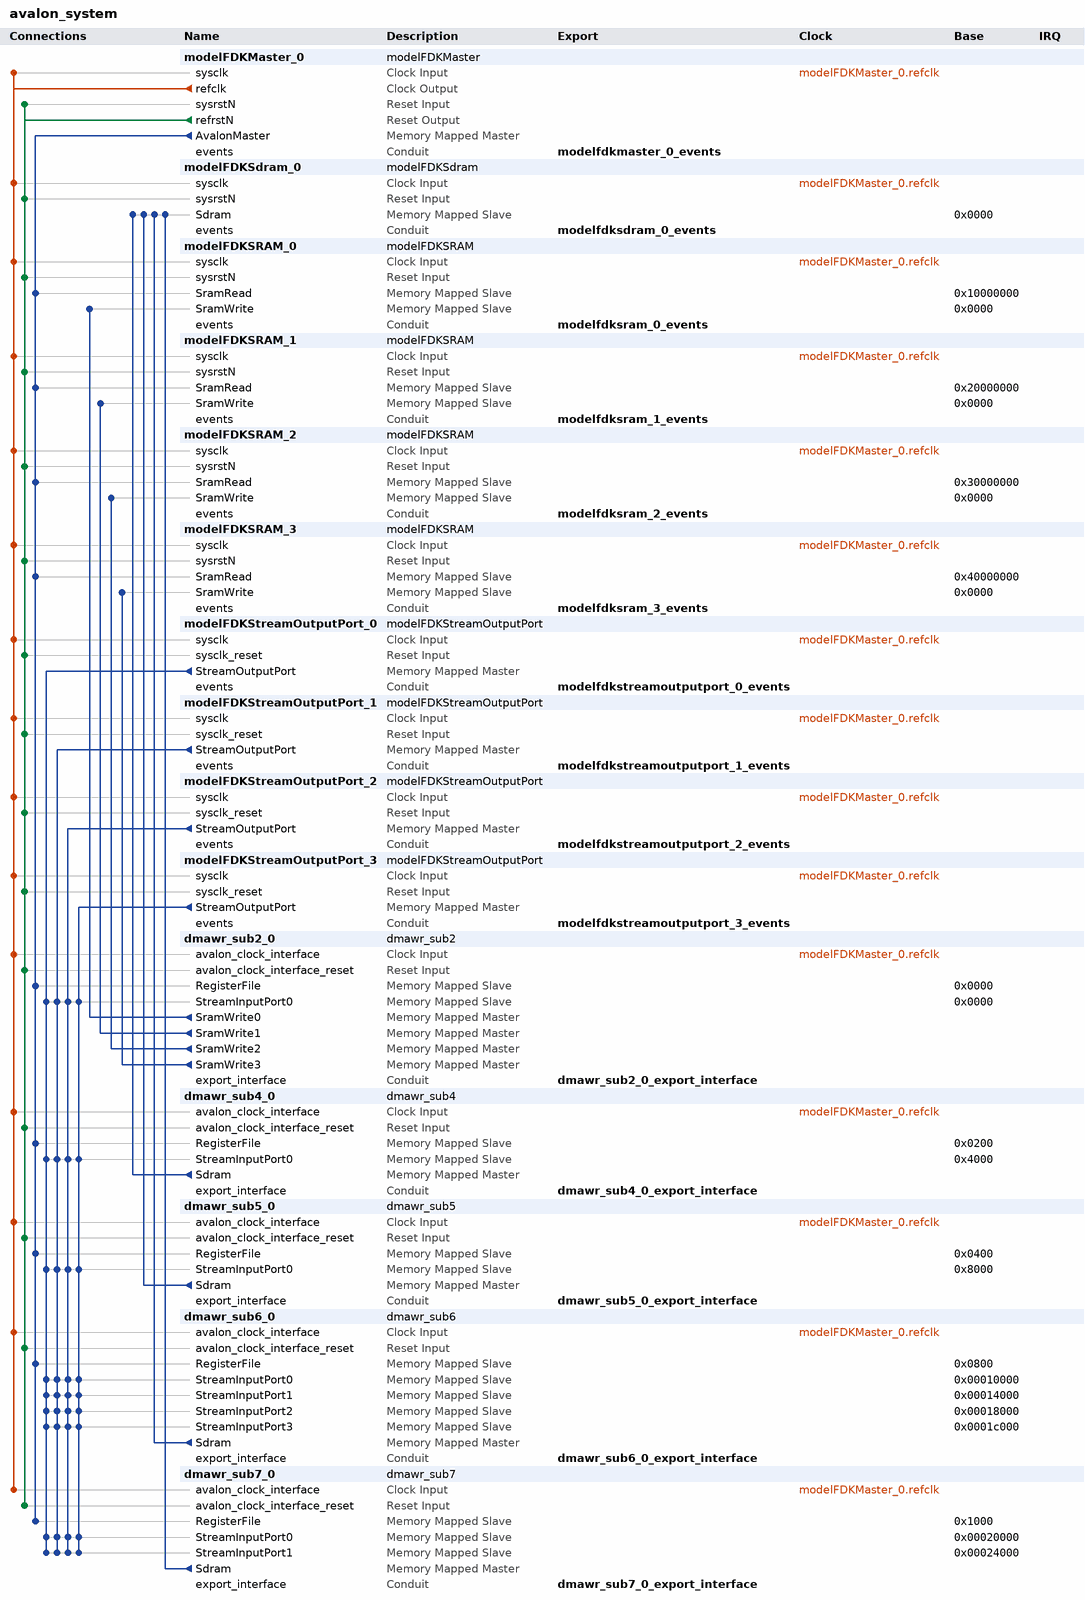
[diagram p0: system contents]
# Platform Designer (Qsys) system avalon_system, Stratix V 5SGSMD5K3F40C4
# Parameters at their usual value, and those the tool derives, are not listed.
package require qsys
create_system avalon_system
set_project_property DEVICE_FAMILY {Stratix V}
set_project_property DEVICE 5SGSMD5K3F40C4

add_instance modelFDKMaster_0 modelFDKMaster 1.0
set_instance_parameter_value modelFDKMaster_0 CMDFILENAME modelmaster0.in
set_instance_parameter_value modelFDKMaster_0 CLKPERIOD 13
set_instance_parameter_value modelFDKMaster_0 ADDREFCLOCK2X false
set_instance_parameter_value modelFDKMaster_0 ADDRBUSWIDTH 32
set_instance_parameter_value modelFDKMaster_0 DATABUSWIDTH 64

add_instance modelFDKSdram_0 modelFDKSdram 1.0
set_instance_parameter_value modelFDKSdram_0 DMPFILENAME ../results/sdramModel.dmp
set_instance_parameter_value modelFDKSdram_0 INITFILENAME sdramModel.init
set_instance_parameter_value modelFDKSdram_0 ADDRBUSWIDTH 24
set_instance_parameter_value modelFDKSdram_0 DATABUSWIDTH 512
set_instance_parameter_value modelFDKSdram_0 WAITCNTRMAX 10
set_instance_parameter_value modelFDKSdram_0 WAITSTART 5
set_instance_parameter_value modelFDKSdram_0 WAITSTOP 2

add_instance modelFDKSRAM_0 modelFDKSRAM 1.0
set_instance_parameter_value modelFDKSRAM_0 DMPFILENAME ../results/sramModel0.dmp
set_instance_parameter_value modelFDKSRAM_0 INITFILENAME sramModel0.init
set_instance_parameter_value modelFDKSRAM_0 ADDRBUSWIDTH 21
set_instance_parameter_value modelFDKSRAM_0 DATABUSWIDTH 32
set_instance_parameter_value modelFDKSRAM_0 WAITCNTRMAX 10
set_instance_parameter_value modelFDKSRAM_0 WAITSTART 5
set_instance_parameter_value modelFDKSRAM_0 WAITSTOP 2

add_instance modelFDKSRAM_1 modelFDKSRAM 1.0
set_instance_parameter_value modelFDKSRAM_1 DMPFILENAME ../results/sramModel1.dmp
set_instance_parameter_value modelFDKSRAM_1 INITFILENAME sramModel1.init
set_instance_parameter_value modelFDKSRAM_1 ADDRBUSWIDTH 21
set_instance_parameter_value modelFDKSRAM_1 DATABUSWIDTH 32
set_instance_parameter_value modelFDKSRAM_1 WAITCNTRMAX 10
set_instance_parameter_value modelFDKSRAM_1 WAITSTART 5
set_instance_parameter_value modelFDKSRAM_1 WAITSTOP 2

add_instance modelFDKSRAM_2 modelFDKSRAM 1.0
set_instance_parameter_value modelFDKSRAM_2 DMPFILENAME ../results/sramModel2.dmp
set_instance_parameter_value modelFDKSRAM_2 INITFILENAME sramModel2.init
set_instance_parameter_value modelFDKSRAM_2 ADDRBUSWIDTH 21
set_instance_parameter_value modelFDKSRAM_2 DATABUSWIDTH 32
set_instance_parameter_value modelFDKSRAM_2 WAITCNTRMAX 10
set_instance_parameter_value modelFDKSRAM_2 WAITSTART 5
set_instance_parameter_value modelFDKSRAM_2 WAITSTOP 2

add_instance modelFDKSRAM_3 modelFDKSRAM 1.0
set_instance_parameter_value modelFDKSRAM_3 DMPFILENAME ../results/sramModel3.dmp
set_instance_parameter_value modelFDKSRAM_3 INITFILENAME sramModel3.init
set_instance_parameter_value modelFDKSRAM_3 ADDRBUSWIDTH 21
set_instance_parameter_value modelFDKSRAM_3 DATABUSWIDTH 32
set_instance_parameter_value modelFDKSRAM_3 WAITCNTRMAX 10
set_instance_parameter_value modelFDKSRAM_3 WAITSTART 5
set_instance_parameter_value modelFDKSRAM_3 WAITSTOP 2

add_instance modelFDKStreamOutputPort_0 modelFDKStreamOutputPort 1.0
set_instance_parameter_value modelFDKStreamOutputPort_0 MODELNAME modelmaster
set_instance_parameter_value modelFDKStreamOutputPort_0 CMDFILENAME sopmodel0.in
set_instance_parameter_value modelFDKStreamOutputPort_0 ADDRBUSWIDTH 32
set_instance_parameter_value modelFDKStreamOutputPort_0 DATABUSWIDTH 64

add_instance modelFDKStreamOutputPort_1 modelFDKStreamOutputPort 1.0
set_instance_parameter_value modelFDKStreamOutputPort_1 MODELNAME modelmaster
set_instance_parameter_value modelFDKStreamOutputPort_1 CMDFILENAME sopmodel1.in
set_instance_parameter_value modelFDKStreamOutputPort_1 ADDRBUSWIDTH 32
set_instance_parameter_value modelFDKStreamOutputPort_1 DATABUSWIDTH 64

add_instance modelFDKStreamOutputPort_2 modelFDKStreamOutputPort 1.0
set_instance_parameter_value modelFDKStreamOutputPort_2 MODELNAME modelmaster
set_instance_parameter_value modelFDKStreamOutputPort_2 CMDFILENAME sopmodel2.in
set_instance_parameter_value modelFDKStreamOutputPort_2 ADDRBUSWIDTH 32
set_instance_parameter_value modelFDKStreamOutputPort_2 DATABUSWIDTH 64

add_instance modelFDKStreamOutputPort_3 modelFDKStreamOutputPort 1.0
set_instance_parameter_value modelFDKStreamOutputPort_3 MODELNAME modelmaster
set_instance_parameter_value modelFDKStreamOutputPort_3 CMDFILENAME sopmodel3.in
set_instance_parameter_value modelFDKStreamOutputPort_3 ADDRBUSWIDTH 32
set_instance_parameter_value modelFDKStreamOutputPort_3 DATABUSWIDTH 64

add_instance dmawr_sub2_0 dmawr_sub2 5.0.0

add_instance dmawr_sub4_0 dmawr_sub4 5.0.0

add_instance dmawr_sub5_0 dmawr_sub5 5.0.0

add_instance dmawr_sub6_0 dmawr_sub6 5.0.0

add_instance dmawr_sub7_0 dmawr_sub7 5.0.0

# connections
add_connection modelFDKMaster_0.refclk dmawr_sub2_0.avalon_clock_interface clock
add_connection modelFDKMaster_0.refclk dmawr_sub4_0.avalon_clock_interface clock
add_connection modelFDKMaster_0.refclk dmawr_sub5_0.avalon_clock_interface clock
add_connection modelFDKMaster_0.refclk dmawr_sub6_0.avalon_clock_interface clock
add_connection modelFDKMaster_0.refclk dmawr_sub7_0.avalon_clock_interface clock
add_connection modelFDKMaster_0.refclk modelFDKMaster_0.sysclk clock
add_connection modelFDKMaster_0.refclk modelFDKSdram_0.sysclk clock
add_connection modelFDKMaster_0.refclk modelFDKSRAM_0.sysclk clock
add_connection modelFDKMaster_0.refclk modelFDKSRAM_1.sysclk clock
add_connection modelFDKMaster_0.refclk modelFDKSRAM_2.sysclk clock
add_connection modelFDKMaster_0.refclk modelFDKSRAM_3.sysclk clock
add_connection modelFDKMaster_0.refclk modelFDKStreamOutputPort_0.sysclk clock
add_connection modelFDKMaster_0.refclk modelFDKStreamOutputPort_1.sysclk clock
add_connection modelFDKMaster_0.refclk modelFDKStreamOutputPort_2.sysclk clock
add_connection modelFDKMaster_0.refclk modelFDKStreamOutputPort_3.sysclk clock
add_connection modelFDKMaster_0.refrstN dmawr_sub2_0.avalon_clock_interface_reset reset
add_connection modelFDKMaster_0.refrstN dmawr_sub4_0.avalon_clock_interface_reset reset
add_connection modelFDKMaster_0.refrstN dmawr_sub5_0.avalon_clock_interface_reset reset
add_connection modelFDKMaster_0.refrstN dmawr_sub6_0.avalon_clock_interface_reset reset
add_connection modelFDKMaster_0.refrstN dmawr_sub7_0.avalon_clock_interface_reset reset
add_connection modelFDKMaster_0.refrstN modelFDKMaster_0.sysrstN reset
add_connection modelFDKMaster_0.refrstN modelFDKSdram_0.sysrstN reset
add_connection modelFDKMaster_0.refrstN modelFDKSRAM_0.sysrstN reset
add_connection modelFDKMaster_0.refrstN modelFDKSRAM_1.sysrstN reset
add_connection modelFDKMaster_0.refrstN modelFDKSRAM_2.sysrstN reset
add_connection modelFDKMaster_0.refrstN modelFDKSRAM_3.sysrstN reset
add_connection modelFDKMaster_0.refrstN modelFDKStreamOutputPort_0.sysclk_reset reset
add_connection modelFDKMaster_0.refrstN modelFDKStreamOutputPort_1.sysclk_reset reset
add_connection modelFDKMaster_0.refrstN modelFDKStreamOutputPort_2.sysclk_reset reset
add_connection modelFDKMaster_0.refrstN modelFDKStreamOutputPort_3.sysclk_reset reset
add_connection dmawr_sub2_0.SramWrite0 modelFDKSRAM_0.SramWrite avalon
set_connection_parameter_value dmawr_sub2_0.SramWrite0/modelFDKSRAM_0.SramWrite baseAddress 0x0000
add_connection dmawr_sub2_0.SramWrite1 modelFDKSRAM_1.SramWrite avalon
set_connection_parameter_value dmawr_sub2_0.SramWrite1/modelFDKSRAM_1.SramWrite baseAddress 0x0000
add_connection dmawr_sub2_0.SramWrite2 modelFDKSRAM_2.SramWrite avalon
set_connection_parameter_value dmawr_sub2_0.SramWrite2/modelFDKSRAM_2.SramWrite baseAddress 0x0000
add_connection dmawr_sub2_0.SramWrite3 modelFDKSRAM_3.SramWrite avalon
set_connection_parameter_value dmawr_sub2_0.SramWrite3/modelFDKSRAM_3.SramWrite baseAddress 0x0000
add_connection dmawr_sub4_0.Sdram modelFDKSdram_0.Sdram avalon
set_connection_parameter_value dmawr_sub4_0.Sdram/modelFDKSdram_0.Sdram baseAddress 0x0000
add_connection dmawr_sub5_0.Sdram modelFDKSdram_0.Sdram avalon
set_connection_parameter_value dmawr_sub5_0.Sdram/modelFDKSdram_0.Sdram baseAddress 0x0000
add_connection dmawr_sub6_0.Sdram modelFDKSdram_0.Sdram avalon
set_connection_parameter_value dmawr_sub6_0.Sdram/modelFDKSdram_0.Sdram baseAddress 0x0000
add_connection dmawr_sub7_0.Sdram modelFDKSdram_0.Sdram avalon
set_connection_parameter_value dmawr_sub7_0.Sdram/modelFDKSdram_0.Sdram baseAddress 0x0000
add_connection modelFDKMaster_0.AvalonMaster dmawr_sub2_0.RegisterFile avalon
set_connection_parameter_value modelFDKMaster_0.AvalonMaster/dmawr_sub2_0.RegisterFile baseAddress 0x0000
add_connection modelFDKMaster_0.AvalonMaster dmawr_sub4_0.RegisterFile avalon
set_connection_parameter_value modelFDKMaster_0.AvalonMaster/dmawr_sub4_0.RegisterFile baseAddress 0x0200
add_connection modelFDKMaster_0.AvalonMaster dmawr_sub5_0.RegisterFile avalon
set_connection_parameter_value modelFDKMaster_0.AvalonMaster/dmawr_sub5_0.RegisterFile baseAddress 0x0400
add_connection modelFDKMaster_0.AvalonMaster dmawr_sub6_0.RegisterFile avalon
set_connection_parameter_value modelFDKMaster_0.AvalonMaster/dmawr_sub6_0.RegisterFile baseAddress 0x0800
add_connection modelFDKMaster_0.AvalonMaster dmawr_sub7_0.RegisterFile avalon
set_connection_parameter_value modelFDKMaster_0.AvalonMaster/dmawr_sub7_0.RegisterFile baseAddress 0x1000
add_connection modelFDKMaster_0.AvalonMaster modelFDKSRAM_0.SramRead avalon
set_connection_parameter_value modelFDKMaster_0.AvalonMaster/modelFDKSRAM_0.SramRead baseAddress 0x10000000
add_connection modelFDKMaster_0.AvalonMaster modelFDKSRAM_1.SramRead avalon
set_connection_parameter_value modelFDKMaster_0.AvalonMaster/modelFDKSRAM_1.SramRead baseAddress 0x20000000
add_connection modelFDKMaster_0.AvalonMaster modelFDKSRAM_2.SramRead avalon
set_connection_parameter_value modelFDKMaster_0.AvalonMaster/modelFDKSRAM_2.SramRead baseAddress 0x30000000
add_connection modelFDKMaster_0.AvalonMaster modelFDKSRAM_3.SramRead avalon
set_connection_parameter_value modelFDKMaster_0.AvalonMaster/modelFDKSRAM_3.SramRead baseAddress 0x40000000
add_connection modelFDKStreamOutputPort_0.StreamOutputPort dmawr_sub2_0.StreamInputPort0 avalon
set_connection_parameter_value modelFDKStreamOutputPort_0.StreamOutputPort/dmawr_sub2_0.StreamInputPort0 baseAddress 0x0000
add_connection modelFDKStreamOutputPort_0.StreamOutputPort dmawr_sub4_0.StreamInputPort0 avalon
set_connection_parameter_value modelFDKStreamOutputPort_0.StreamOutputPort/dmawr_sub4_0.StreamInputPort0 baseAddress 0x4000
add_connection modelFDKStreamOutputPort_0.StreamOutputPort dmawr_sub5_0.StreamInputPort0 avalon
set_connection_parameter_value modelFDKStreamOutputPort_0.StreamOutputPort/dmawr_sub5_0.StreamInputPort0 baseAddress 0x8000
add_connection modelFDKStreamOutputPort_0.StreamOutputPort dmawr_sub6_0.StreamInputPort0 avalon
set_connection_parameter_value modelFDKStreamOutputPort_0.StreamOutputPort/dmawr_sub6_0.StreamInputPort0 baseAddress 0x00010000
add_connection modelFDKStreamOutputPort_0.StreamOutputPort dmawr_sub6_0.StreamInputPort1 avalon
set_connection_parameter_value modelFDKStreamOutputPort_0.StreamOutputPort/dmawr_sub6_0.StreamInputPort1 baseAddress 0x00014000
add_connection modelFDKStreamOutputPort_0.StreamOutputPort dmawr_sub6_0.StreamInputPort2 avalon
set_connection_parameter_value modelFDKStreamOutputPort_0.StreamOutputPort/dmawr_sub6_0.StreamInputPort2 baseAddress 0x00018000
add_connection modelFDKStreamOutputPort_0.StreamOutputPort dmawr_sub6_0.StreamInputPort3 avalon
set_connection_parameter_value modelFDKStreamOutputPort_0.StreamOutputPort/dmawr_sub6_0.StreamInputPort3 baseAddress 0x0001c000
add_connection modelFDKStreamOutputPort_0.StreamOutputPort dmawr_sub7_0.StreamInputPort0 avalon
set_connection_parameter_value modelFDKStreamOutputPort_0.StreamOutputPort/dmawr_sub7_0.StreamInputPort0 baseAddress 0x00020000
add_connection modelFDKStreamOutputPort_0.StreamOutputPort dmawr_sub7_0.StreamInputPort1 avalon
set_connection_parameter_value modelFDKStreamOutputPort_0.StreamOutputPort/dmawr_sub7_0.StreamInputPort1 baseAddress 0x00024000
add_connection modelFDKStreamOutputPort_1.StreamOutputPort dmawr_sub2_0.StreamInputPort0 avalon
set_connection_parameter_value modelFDKStreamOutputPort_1.StreamOutputPort/dmawr_sub2_0.StreamInputPort0 baseAddress 0x0000
add_connection modelFDKStreamOutputPort_1.StreamOutputPort dmawr_sub4_0.StreamInputPort0 avalon
set_connection_parameter_value modelFDKStreamOutputPort_1.StreamOutputPort/dmawr_sub4_0.StreamInputPort0 baseAddress 0x4000
add_connection modelFDKStreamOutputPort_1.StreamOutputPort dmawr_sub5_0.StreamInputPort0 avalon
set_connection_parameter_value modelFDKStreamOutputPort_1.StreamOutputPort/dmawr_sub5_0.StreamInputPort0 baseAddress 0x8000
add_connection modelFDKStreamOutputPort_1.StreamOutputPort dmawr_sub6_0.StreamInputPort0 avalon
set_connection_parameter_value modelFDKStreamOutputPort_1.StreamOutputPort/dmawr_sub6_0.StreamInputPort0 baseAddress 0x00010000
add_connection modelFDKStreamOutputPort_1.StreamOutputPort dmawr_sub6_0.StreamInputPort1 avalon
set_connection_parameter_value modelFDKStreamOutputPort_1.StreamOutputPort/dmawr_sub6_0.StreamInputPort1 baseAddress 0x00014000
add_connection modelFDKStreamOutputPort_1.StreamOutputPort dmawr_sub6_0.StreamInputPort2 avalon
set_connection_parameter_value modelFDKStreamOutputPort_1.StreamOutputPort/dmawr_sub6_0.StreamInputPort2 baseAddress 0x00018000
add_connection modelFDKStreamOutputPort_1.StreamOutputPort dmawr_sub6_0.StreamInputPort3 avalon
set_connection_parameter_value modelFDKStreamOutputPort_1.StreamOutputPort/dmawr_sub6_0.StreamInputPort3 baseAddress 0x0001c000
add_connection modelFDKStreamOutputPort_1.StreamOutputPort dmawr_sub7_0.StreamInputPort0 avalon
set_connection_parameter_value modelFDKStreamOutputPort_1.StreamOutputPort/dmawr_sub7_0.StreamInputPort0 baseAddress 0x00020000
add_connection modelFDKStreamOutputPort_1.StreamOutputPort dmawr_sub7_0.StreamInputPort1 avalon
set_connection_parameter_value modelFDKStreamOutputPort_1.StreamOutputPort/dmawr_sub7_0.StreamInputPort1 baseAddress 0x00024000
add_connection modelFDKStreamOutputPort_2.StreamOutputPort dmawr_sub2_0.StreamInputPort0 avalon
set_connection_parameter_value modelFDKStreamOutputPort_2.StreamOutputPort/dmawr_sub2_0.StreamInputPort0 baseAddress 0x0000
add_connection modelFDKStreamOutputPort_2.StreamOutputPort dmawr_sub4_0.StreamInputPort0 avalon
set_connection_parameter_value modelFDKStreamOutputPort_2.StreamOutputPort/dmawr_sub4_0.StreamInputPort0 baseAddress 0x4000
add_connection modelFDKStreamOutputPort_2.StreamOutputPort dmawr_sub5_0.StreamInputPort0 avalon
set_connection_parameter_value modelFDKStreamOutputPort_2.StreamOutputPort/dmawr_sub5_0.StreamInputPort0 baseAddress 0x8000
add_connection modelFDKStreamOutputPort_2.StreamOutputPort dmawr_sub6_0.StreamInputPort0 avalon
set_connection_parameter_value modelFDKStreamOutputPort_2.StreamOutputPort/dmawr_sub6_0.StreamInputPort0 baseAddress 0x00010000
add_connection modelFDKStreamOutputPort_2.StreamOutputPort dmawr_sub6_0.StreamInputPort1 avalon
set_connection_parameter_value modelFDKStreamOutputPort_2.StreamOutputPort/dmawr_sub6_0.StreamInputPort1 baseAddress 0x00014000
add_connection modelFDKStreamOutputPort_2.StreamOutputPort dmawr_sub6_0.StreamInputPort2 avalon
set_connection_parameter_value modelFDKStreamOutputPort_2.StreamOutputPort/dmawr_sub6_0.StreamInputPort2 baseAddress 0x00018000
add_connection modelFDKStreamOutputPort_2.StreamOutputPort dmawr_sub6_0.StreamInputPort3 avalon
set_connection_parameter_value modelFDKStreamOutputPort_2.StreamOutputPort/dmawr_sub6_0.StreamInputPort3 baseAddress 0x0001c000
add_connection modelFDKStreamOutputPort_2.StreamOutputPort dmawr_sub7_0.StreamInputPort0 avalon
set_connection_parameter_value modelFDKStreamOutputPort_2.StreamOutputPort/dmawr_sub7_0.StreamInputPort0 baseAddress 0x00020000
add_connection modelFDKStreamOutputPort_2.StreamOutputPort dmawr_sub7_0.StreamInputPort1 avalon
set_connection_parameter_value modelFDKStreamOutputPort_2.StreamOutputPort/dmawr_sub7_0.StreamInputPort1 baseAddress 0x00024000
add_connection modelFDKStreamOutputPort_3.StreamOutputPort dmawr_sub2_0.StreamInputPort0 avalon
set_connection_parameter_value modelFDKStreamOutputPort_3.StreamOutputPort/dmawr_sub2_0.StreamInputPort0 baseAddress 0x0000
add_connection modelFDKStreamOutputPort_3.StreamOutputPort dmawr_sub4_0.StreamInputPort0 avalon
set_connection_parameter_value modelFDKStreamOutputPort_3.StreamOutputPort/dmawr_sub4_0.StreamInputPort0 baseAddress 0x4000
add_connection modelFDKStreamOutputPort_3.StreamOutputPort dmawr_sub5_0.StreamInputPort0 avalon
set_connection_parameter_value modelFDKStreamOutputPort_3.StreamOutputPort/dmawr_sub5_0.StreamInputPort0 baseAddress 0x8000
add_connection modelFDKStreamOutputPort_3.StreamOutputPort dmawr_sub6_0.StreamInputPort0 avalon
set_connection_parameter_value modelFDKStreamOutputPort_3.StreamOutputPort/dmawr_sub6_0.StreamInputPort0 baseAddress 0x00010000
add_connection modelFDKStreamOutputPort_3.StreamOutputPort dmawr_sub6_0.StreamInputPort1 avalon
set_connection_parameter_value modelFDKStreamOutputPort_3.StreamOutputPort/dmawr_sub6_0.StreamInputPort1 baseAddress 0x00014000
add_connection modelFDKStreamOutputPort_3.StreamOutputPort dmawr_sub6_0.StreamInputPort2 avalon
set_connection_parameter_value modelFDKStreamOutputPort_3.StreamOutputPort/dmawr_sub6_0.StreamInputPort2 baseAddress 0x00018000
add_connection modelFDKStreamOutputPort_3.StreamOutputPort dmawr_sub6_0.StreamInputPort3 avalon
set_connection_parameter_value modelFDKStreamOutputPort_3.StreamOutputPort/dmawr_sub6_0.StreamInputPort3 baseAddress 0x0001c000
add_connection modelFDKStreamOutputPort_3.StreamOutputPort dmawr_sub7_0.StreamInputPort0 avalon
set_connection_parameter_value modelFDKStreamOutputPort_3.StreamOutputPort/dmawr_sub7_0.StreamInputPort0 baseAddress 0x00020000
add_connection modelFDKStreamOutputPort_3.StreamOutputPort dmawr_sub7_0.StreamInputPort1 avalon
set_connection_parameter_value modelFDKStreamOutputPort_3.StreamOutputPort/dmawr_sub7_0.StreamInputPort1 baseAddress 0x00024000

# exported interfaces
add_interface modelfdksram_0_events conduit end
set_interface_property modelfdksram_0_events EXPORT_OF modelFDKSRAM_0.events
add_interface modelfdksram_1_events conduit end
set_interface_property modelfdksram_1_events EXPORT_OF modelFDKSRAM_1.events
add_interface modelfdksram_2_events conduit end
set_interface_property modelfdksram_2_events EXPORT_OF modelFDKSRAM_2.events
add_interface modelfdksram_3_events conduit end
set_interface_property modelfdksram_3_events EXPORT_OF modelFDKSRAM_3.events
add_interface dmawr_sub2_0_export_interface conduit end
set_interface_property dmawr_sub2_0_export_interface EXPORT_OF dmawr_sub2_0.export_interface
add_interface modelfdkstreamoutputport_0_events conduit end
set_interface_property modelfdkstreamoutputport_0_events EXPORT_OF modelFDKStreamOutputPort_0.events
add_interface modelfdkstreamoutputport_3_events conduit end
set_interface_property modelfdkstreamoutputport_3_events EXPORT_OF modelFDKStreamOutputPort_3.events
add_interface modelfdkstreamoutputport_1_events conduit end
set_interface_property modelfdkstreamoutputport_1_events EXPORT_OF modelFDKStreamOutputPort_1.events
add_interface modelfdkstreamoutputport_2_events conduit end
set_interface_property modelfdkstreamoutputport_2_events EXPORT_OF modelFDKStreamOutputPort_2.events
add_interface modelfdksdram_0_events conduit end
set_interface_property modelfdksdram_0_events EXPORT_OF modelFDKSdram_0.events
add_interface dmawr_sub4_0_export_interface conduit end
set_interface_property dmawr_sub4_0_export_interface EXPORT_OF dmawr_sub4_0.export_interface
add_interface dmawr_sub6_0_export_interface conduit end
set_interface_property dmawr_sub6_0_export_interface EXPORT_OF dmawr_sub6_0.export_interface
add_interface dmawr_sub7_0_export_interface conduit end
set_interface_property dmawr_sub7_0_export_interface EXPORT_OF dmawr_sub7_0.export_interface
add_interface dmawr_sub5_0_export_interface conduit end
set_interface_property dmawr_sub5_0_export_interface EXPORT_OF dmawr_sub5_0.export_interface
add_interface modelfdkmaster_0_events conduit end
set_interface_property modelfdkmaster_0_events EXPORT_OF modelFDKMaster_0.events

set_interconnect_requirement {$system} qsys_mm.clockCrossingAdapter HANDSHAKE
set_interconnect_requirement {$system} qsys_mm.maxAdditionalLatency 1

save_system avalon_system.qsys
